# Altium project Power Board UCC28951.PrjPcb (part 4 of 4)

## Sheet E_Switch.SchDoc
size A3
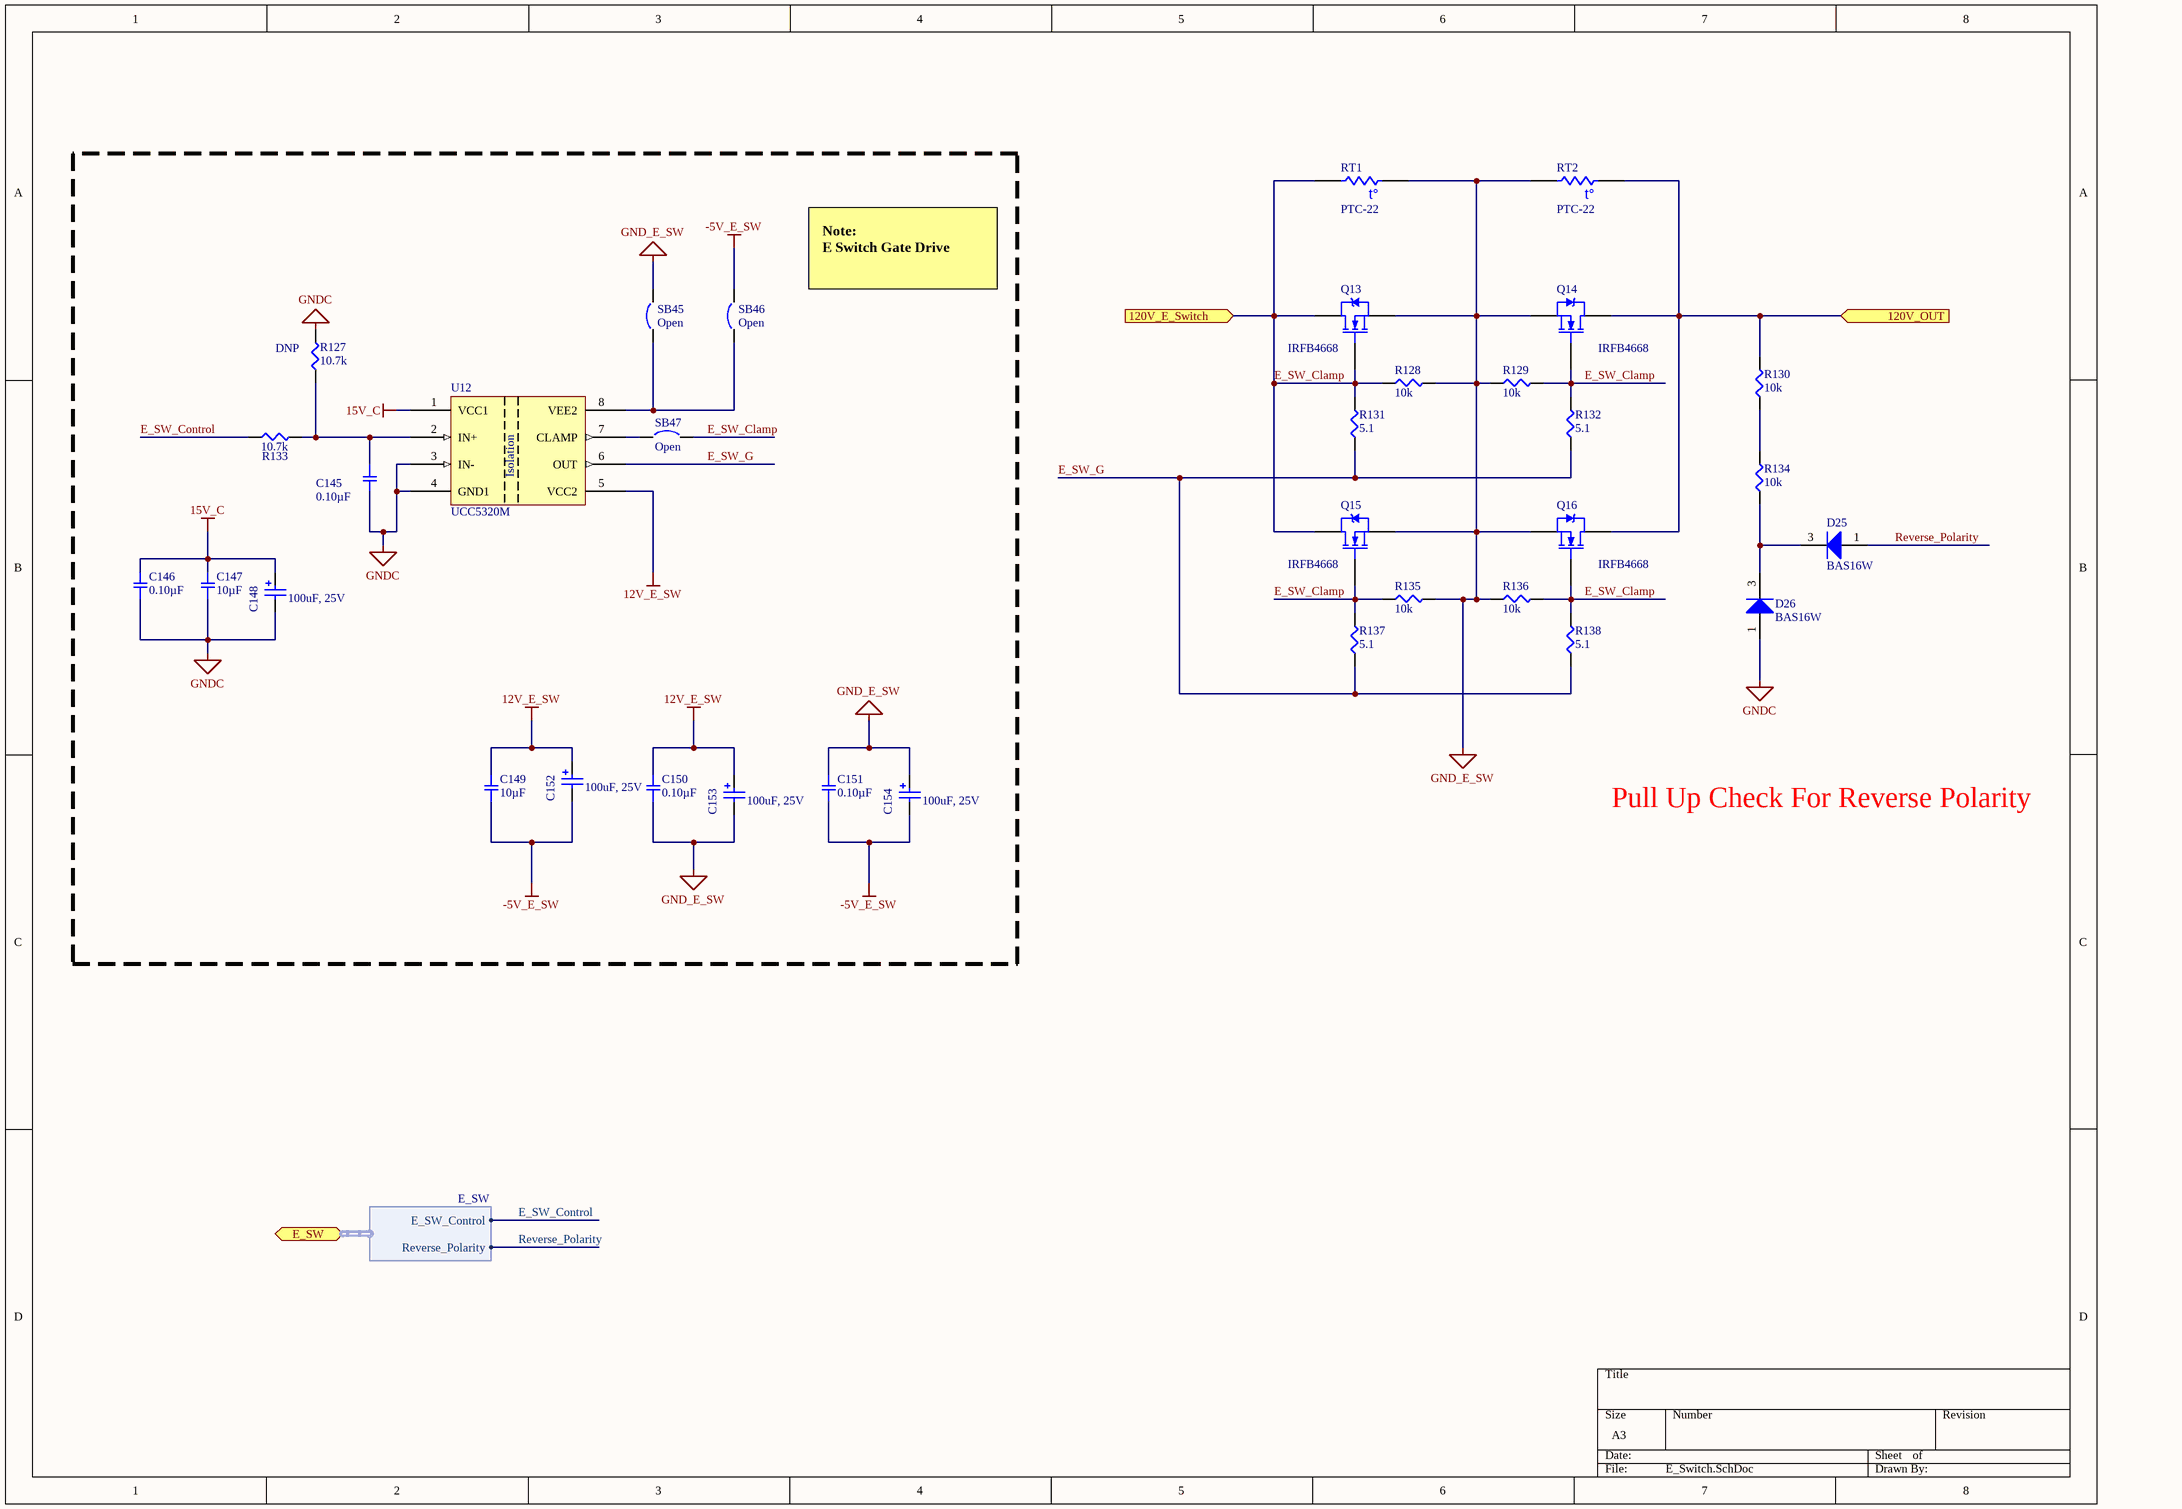
[diagram p17: E_Switch.SchDoc]

### Parts
(Parts that share a designator on the sheet are numbered #1, #2 ... from top to bottom, then left to right.)
C145#2  0.10µF  [SMD-0603C]
C146#2  0.10µF  [SMD-0805C]
C147#2  10µF  [SMD-0805C]
C148#2  100uF, 25V  [WCAP-ASLL_6.3x7.7]
C149#2  10µF  [SMD-0805C]
C150#2  0.10µF  [SMD-0805C]
C151#2  0.10µF  [SMD-0805C]
C152#2  100uF, 25V  [WCAP-ASLL_6.3x7.7]
C153#2  100uF, 25V  [WCAP-ASLL_6.3x7.7]
C154#2  100uF, 25V  [WCAP-ASLL_6.3x7.7]
D25  BAS16W  [SOT95P278X110-3N]
D26#2  BAS16W  [SOT95P278X110-3N]
Q13  IRFB4668  [TO-220AB]
Q14  IRFB4668  [TO-220AB]
Q15  IRFB4668  [TO-220AB]
Q16  IRFB4668  [TO-220AB]
R127#2  10.7k  [SMD-0603-RES]
R128#2  10k  [SMD-1206-RES]
R129#2  10k  [SMD-1206-RES]
R130#2  10k  [SMD-1206-RES]
R131#2  5.1  [SMD-1206-RES]
R132#2  5.1  [SMD-1206-RES]
R133#2  10.7k  [SMD-0603-RES]
R134#2  10k  [SMD-1206-RES]
R135  10k  [SMD-1206-RES]
R136  10k  [SMD-1206-RES]
R137  5.1  [SMD-1206-RES]
R138  5.1  [SMD-1206-RES]
RT1  PTC-22  [PTCEL-17R]
RT2  PTC-22  [PTCEL-17R]
SB45#2  Open  [Solder Bridge - HP]  (no BOM)
SB46  Open  [Solder Bridge - HP]  (no BOM)
SB47  Open  [Solder Bridge - HP]  (no BOM)
U12  UCC5320M  [SOIC127P570X175_HS-9N]

### Blocks framed on the sheet
DNP: C145#2 C146#2 C147#2 C148#2 C149#2 C150#2 C151#2 C152#2 C153#2 C154#2 R127#2 R133#2 SB45#2 SB46 SB47 U12

### Ports
120V_E_Switch (in), 120V_OUT (in), E_SW (bidir, harness E_SW)

### Harnesses
E_SW: E_SW_Control, Reverse_Polarity

### Nets
12V_E_SW: C149#2.2 C150#2.2 C152#2.2(P) C153#2.2(P) U12.5(VCC2)
15V_C: C146#2.2 C147#2.2 C148#2.2(P) U12.1(VCC1)
-5V_E_SW: C149#2.1 C151#2.1 C152#2.1(N) C154#2.1(N) SB46.2
GND_E_SW: C150#2.1 C151#2.2 C153#2.1(N) C154#2.2(P) Q13.3(S) Q14.3(S) Q15.3(S) Q16.3(S) R128#2.2 R129#2.1 R135.2 R136.1 RT1.1 RT2.2 SB45#2.2
GNDC: C145#2.2 C146#2.1 C147#2.1 C148#2.1(N) D26#2.1(A) R127#2.2 U12.3(IN-) U12.4(GND1)  [project net GND_LV]
120V_OUT: Q14.2(D) Q16.2(D) R130#2.2 RT2.1 ; port 120V_OUT
E_SW_Clamp: Q13.1(G) Q13.2(D) Q14.1(G) Q15.1(G) Q15.2(D) Q16.1(G) R128#2.1 R129#2.2 R131#2.2 R132#2.2 R135.1 R136.2 R137.2 R138.2 RT1.2 SB47.2 ; port 120V_E_Switch
E_SW_Control: R133#2.1 ; port E_SW.E_SW_Control
E_SW_G: R131#2.1 R132#2.1 R137.1 R138.1 U12.6(OUT)
Reverse_Polarity: D25.1(A) ; port E_SW.Reverse_Polarity
NetC145#2_1: C145#2.1 R127#2.1 R133#2.2 U12.2(IN+)
NetD25_3: D25.3(K) D26#2.3(K) R134#2.1
NetR130#2_1: R130#2.1 R134#2.2
NetSB45#2_1: SB45#2.1 SB46.1 U12.8(VEE2)
NetSB47_1: SB47.1 U12.7(CLAMP)

### Notes on the sheet
- Note:
  E Switch Gate Drive
- Pull Up Check For Reverse Polarity
- (in symbol Res Thermal) t°
- (in symbol UCC5320M) Isolation

### Library data of the parts
C145#2 = GCJ188R72A104KA01D: CAP CER 0.1UF 100V X7R 0603; Manufacturer: Murata Electronics North America; Factory Stock: 0; Unit Price (USD): 0.23; Minimum Quantity: 1; Tolerance: ±10%; Datasheets: http://www.murata.com/~/media/webrenewal/support/library/catalog/products/capacitor/mlcc/c03e.ashx; Image: //media.digikey.com/Renders/Murata%20Renders/0603%28LQG18%29.jpg; Digi-Key Part Number: 490-13420-1-ND; Part Number: GCJ188R72A104KA01D; Quantity Available: 2728; @ qty: 0; Packaging: Cut Tape (CT); Series: GCJ; Part Status: Active; Value: 0.10µF; Voltage: 100V; Temperature Coefficient: X7R; Operating Temperature: -55°C ~ 125°C; Features: Soft Termination; Ratings: AEC-Q200; Applications: Automotive, Boardflex Sensitive; Mounting Type: Surface Mount, MLCC; Package / Case: 0603 (1608 Metric); Size / Dimension: 0.063" L x 0.031" W (1.60mm x 0.80mm); Height - Seated (Max): -; Thickness (Max): 0.035" (0.90mm); Lead Spacing: -; Lead Style: -
C146#2 C150#2 C151#2 = GCD21BR71H104KA01L: CAP CER 0.1UF 50V X7R 0805; Manufacturer: Murata Electronics North America; Factory Stock: 0; Unit Price (USD): 0.24; Minimum Quantity: 1; Tolerance: ±10%; Datasheets: http://www.murata.com/~/media/webrenewal/support/library/catalog/products/capacitor/mlcc/c03e.ashx; Image: //media.digikey.com/Renders/Murata%20Renders/0805%28GxM6%29.jpg; Digi-Key Part Number: 490-11955-1-ND; Part Number: GCD21BR71H104KA01L; Quantity Available: 157; @ qty: 0; Packaging: Cut Tape (CT); Series: GCD; Part Status: Active; Value: 0.10µF; Voltage: 50V; Temperature Coefficient: X7R; Operating Temperature: -55°C ~ 125°C; Features: -; Ratings: AEC-Q200; Applications: Automotive; Mounting Type: Surface Mount, MLCC; Package / Case: 0805 (2012 Metric); Size / Dimension: 0.079" L x 0.049" W (2.00mm x 1.25mm); Height - Seated (Max): -; Thickness (Max): 0.049" (1.25mm); Lead Spacing: -; Lead Style: -
C147#2 C149#2 = GRM21BC8YA106KE11L: CAP CER 10UF 35V X6S 0805; Manufacturer: Murata Electronics North America; Factory Stock: 0; Unit Price (USD): 0.33; Minimum Quantity: 1; Tolerance: ±10%; Datasheets: http://www.murata.com/~/media/webrenewal/support/library/catalog/products/capacitor/mlcc/c02e.pdf; Image: //media.digikey.com/Renders/Murata%20Renders/0805%20(2012%20Metric)%20.85mm.jpg; Digi-Key Part Number: 490-10504-1-ND; Part Number: GRM21BC8YA106KE11L; Quantity Available: 72253; @ qty: 0; Packaging: Cut Tape (CT); Series: GRM; Part Status: Active; Value: 10µF; Voltage: 35V; Temperature Coefficient: X6S; Operating Temperature: -55°C ~ 105°C; Features: Derating Recommended; Ratings: -; Applications: General Purpose; Mounting Type: Surface Mount, MLCC; Package / Case: 0805 (2012 Metric); Size / Dimension: 0.079" L x 0.049" W (2.00mm x 1.25mm); Height - Seated (Max): -; Thickness (Max): 0.057" (1.45mm); Lead Spacing: -; Lead Style: -
C148#2 C152#2 C153#2 C154#2 = 865060445005: WCAP-ASLL SMT Aluminum Electrolytic Capacitors, D6.3mm x L7.7mm, 100uF, +/-20%, 25VDC; Dissipation Factor: 14%; Endurance: 2000h; Leakage Current: 25uA; Ripple Current max.: 300mA; Technical Reference: ASED077101M025DVCTCB000; ComponentLink1Description: Manufacturer; ComponentLink1URL: http://www.we-online.de; ComponentLink2Description: Datasheet; ComponentLink2URL: https://katalog.we-online.com/pbs/datasheet/865060445005.pdf; Length: 7.7mm; Mounting Technology: SMT; Operating Temperature: -55 to +105degC; Packaging: Tape and Reel; Published Date: August 2019; Capacitance: 100uF; Diameter: 6.3mm; Part Number: 865060445005; Publisher: Wurth Elektronik; Capacitance Tolerance: +/-20%; Rated Voltage: 25VDC
D25 D26#2 = BAS16: Silicon Switching Diode, SOT323, Reel, Green; Manufacturer: Infineon; IR (max): 100Â nA; Configuration: Single; VBR (min): 85Â V; VR (max): 80Â V; trr (max): 4Â ns; Green: TRUE; VF (max): 1.25Â V; IF (max): 250Â mA; Mounting Technology: Surface Mount; PackageReference: SOT323; ComponentLink2URL: http://www.infineon.com/dgdl/bas16series.pdf?folderId=db3a30431400ef6801141b5844e103ea&fileId=db3a30431400ef6801141b93811b03ff; Halogen-free: TRUE; ComponentLink2Description: Datasheet; PartNumber: BAS16W; ComponentLink1Description: Manufacturer URL; ComponentLink3URL: http://www.infineon.com/dgdl/SOT323-Package_Overview.pdf?folderId=db3a30431936bc4b0119533e1dcb3c92&fileId=db3a30431936bc4b011953495f283cb1; ComponentLink1URL: http://www.infineon.com/; PackageDescription: 3-Pin Small Outline Transistor Package, 1.25 x 2 mm Body, 0.65 mm Pitch; ComponentLink3Description: Package Specification
Q13-Q16 = NMOS-2: N-Channel Power MOSFET; Note: Pin 2 is electrically connected to pin 4.; Published: 8-Jun-2000; LatestRevisionDate: 17-Jul-2002; LatestRevisionNote: Re-released for DXP Platform.; DatasheetVersion: PD-9.814; PackageVersion: Feb-1997; PackageReference: TO-220AB; Publisher: Altium Limited; PackageDescription: TO, Thru-Hole, Vertical, Heatsink Mounted; 3 In-Line Leads; Pitch 2.54 mm; ComponentLink1Description: Manufacturer Link; ComponentLink1URL: http://www.irf.com/
R127#2 R133#2 = ERJ-3EKF1072V: RES SMD 10.7K OHM 1% 1/10W 0603; Manufacturer: Panasonic Electronic Components; Factory Stock: 0; Unit Price (USD): 0.00379; @ qty: 1500; Minimum Quantity: 1; Power (Watts): 0.1W, 1/10W; Temperature Coefficient: ±100ppm/°C; Part Number: ERJ-3EKF1072V; Datasheets: http://industrial.panasonic.com/www-cgi/jvcr13pz.cgi?E+PZ+3+AOA0002+ERJ3EKF1072V+7+WW; Image: //media.digikey.com/Photos/Panasonic%20Photos/MFG_ERJ-P6W%20Series.jpg; Digi-Key Part Number: P10.7KHCT-ND; Quantity Available: 142624; Packaging: Cut Tape (CT); Series: ERJ; Part Status: Active; Value: 10.7k; Tolerance: ±1%; Composition: Thick Film; Features: Automotive AEC-Q200; Operating Temperature: -55°C ~ 155°C; Package / Case: 0603 (1608 Metric); Supplier Device Package: 0603; Size / Dimension: 0.063" L x 0.031" W (1.60mm x 0.80mm); Height - Seated (Max): 0.022" (0.55mm); Number of Terminations: 2; Failure Rate: -
R128#2 R129#2 R130#2 R134#2 R135 R136 = ERJ-8ENF1002V: as R89-R92 on sheet Synchronous Rectification Stage; Part Number: ERJ-8ENF1002V; Datasheets: http://industrial.panasonic.com/www-cgi/jvcr13pz.cgi?E+PZ+3+AOA0002+ERJ8ENF1002V+7+WW; Image: //media.digikey.com/Renders/Panasonic%20Renders/ERJ-1206%20Pkg.jpg; Digi-Key Part Number: P10.0KFCT-ND; Quantity Available: 1108398; Packaging: Cut Tape (CT); Series: ERJ; Part Status: Active; Value: 10k; Tolerance: ±1%; Composition: Thick Film; Features: Automotive AEC-Q200; Operating Temperature: -55°C ~ 155°C; Package / Case: 1206 (3216 Metric); Supplier Device Package: 1206; Size / Dimension: 0.126" L x 0.063" W (3.20mm x 1.60mm); Height - Seated (Max): 0.028" (0.70mm); Number of Terminations: 2; Failure Rate: -
R131#2 R132#2 R137 R138 = ERJ-8BQF5R1V: as R85-R88 on sheet Synchronous Rectification Stage; Part Number: ERJ-8BQF5R1V; Datasheets: https://industrial.panasonic.com/cdbs/www-data/pdf/RDA0000/AOA0000C239.pdf; Image: //media.digikey.com/Renders/Panasonic%20Renders/ERJ-1206%20Pkg.jpg; Digi-Key Part Number: P17617CT-ND; Quantity Available: 4802; Packaging: Cut Tape (CT); Series: ERJ; Part Status: Active; Value: 5.1; Tolerance: ±1%; Composition: Thick Film; Features: Automotive AEC-Q200, Current Sense; Operating Temperature: -55°C ~ 125°C; Package / Case: 1206 (3216 Metric); Supplier Device Package: 1206; Size / Dimension: 0.126" L x 0.063" W (3.20mm x 1.60mm); Height - Seated (Max): 0.028" (0.70mm); Number of Terminations: 2; Failure Rate: -
RT1 RT2 = Res Thermal: PTC Thermistor; Published: 24-Mar-1999; LatestRevisionDate: 29-May-2009; LatestRevisionNote: IPC-7351 Footprint Added.; PackageVersion: Mar-2003; PackageReference: 6-0805; Publisher: Altium Limited; PackageDescription: Chip Resistor 0805 Case Size; Code_IPC: RESC2012
SB45#2 SB46 SB47 = Solder Bridge: Circuit Breaker; Published: 24-Mar-1999; Revision: July-2002: Re-released for DXP Platform.; Publisher: Altium Limited
U12 = UCC5320M: Single-Channel Isolated Gate Drivers; Supplier 1: Digi-Key; Supplier Part Number 1: 296-49025-1-ND

## Sheet Fan Control.SchDoc
size A3
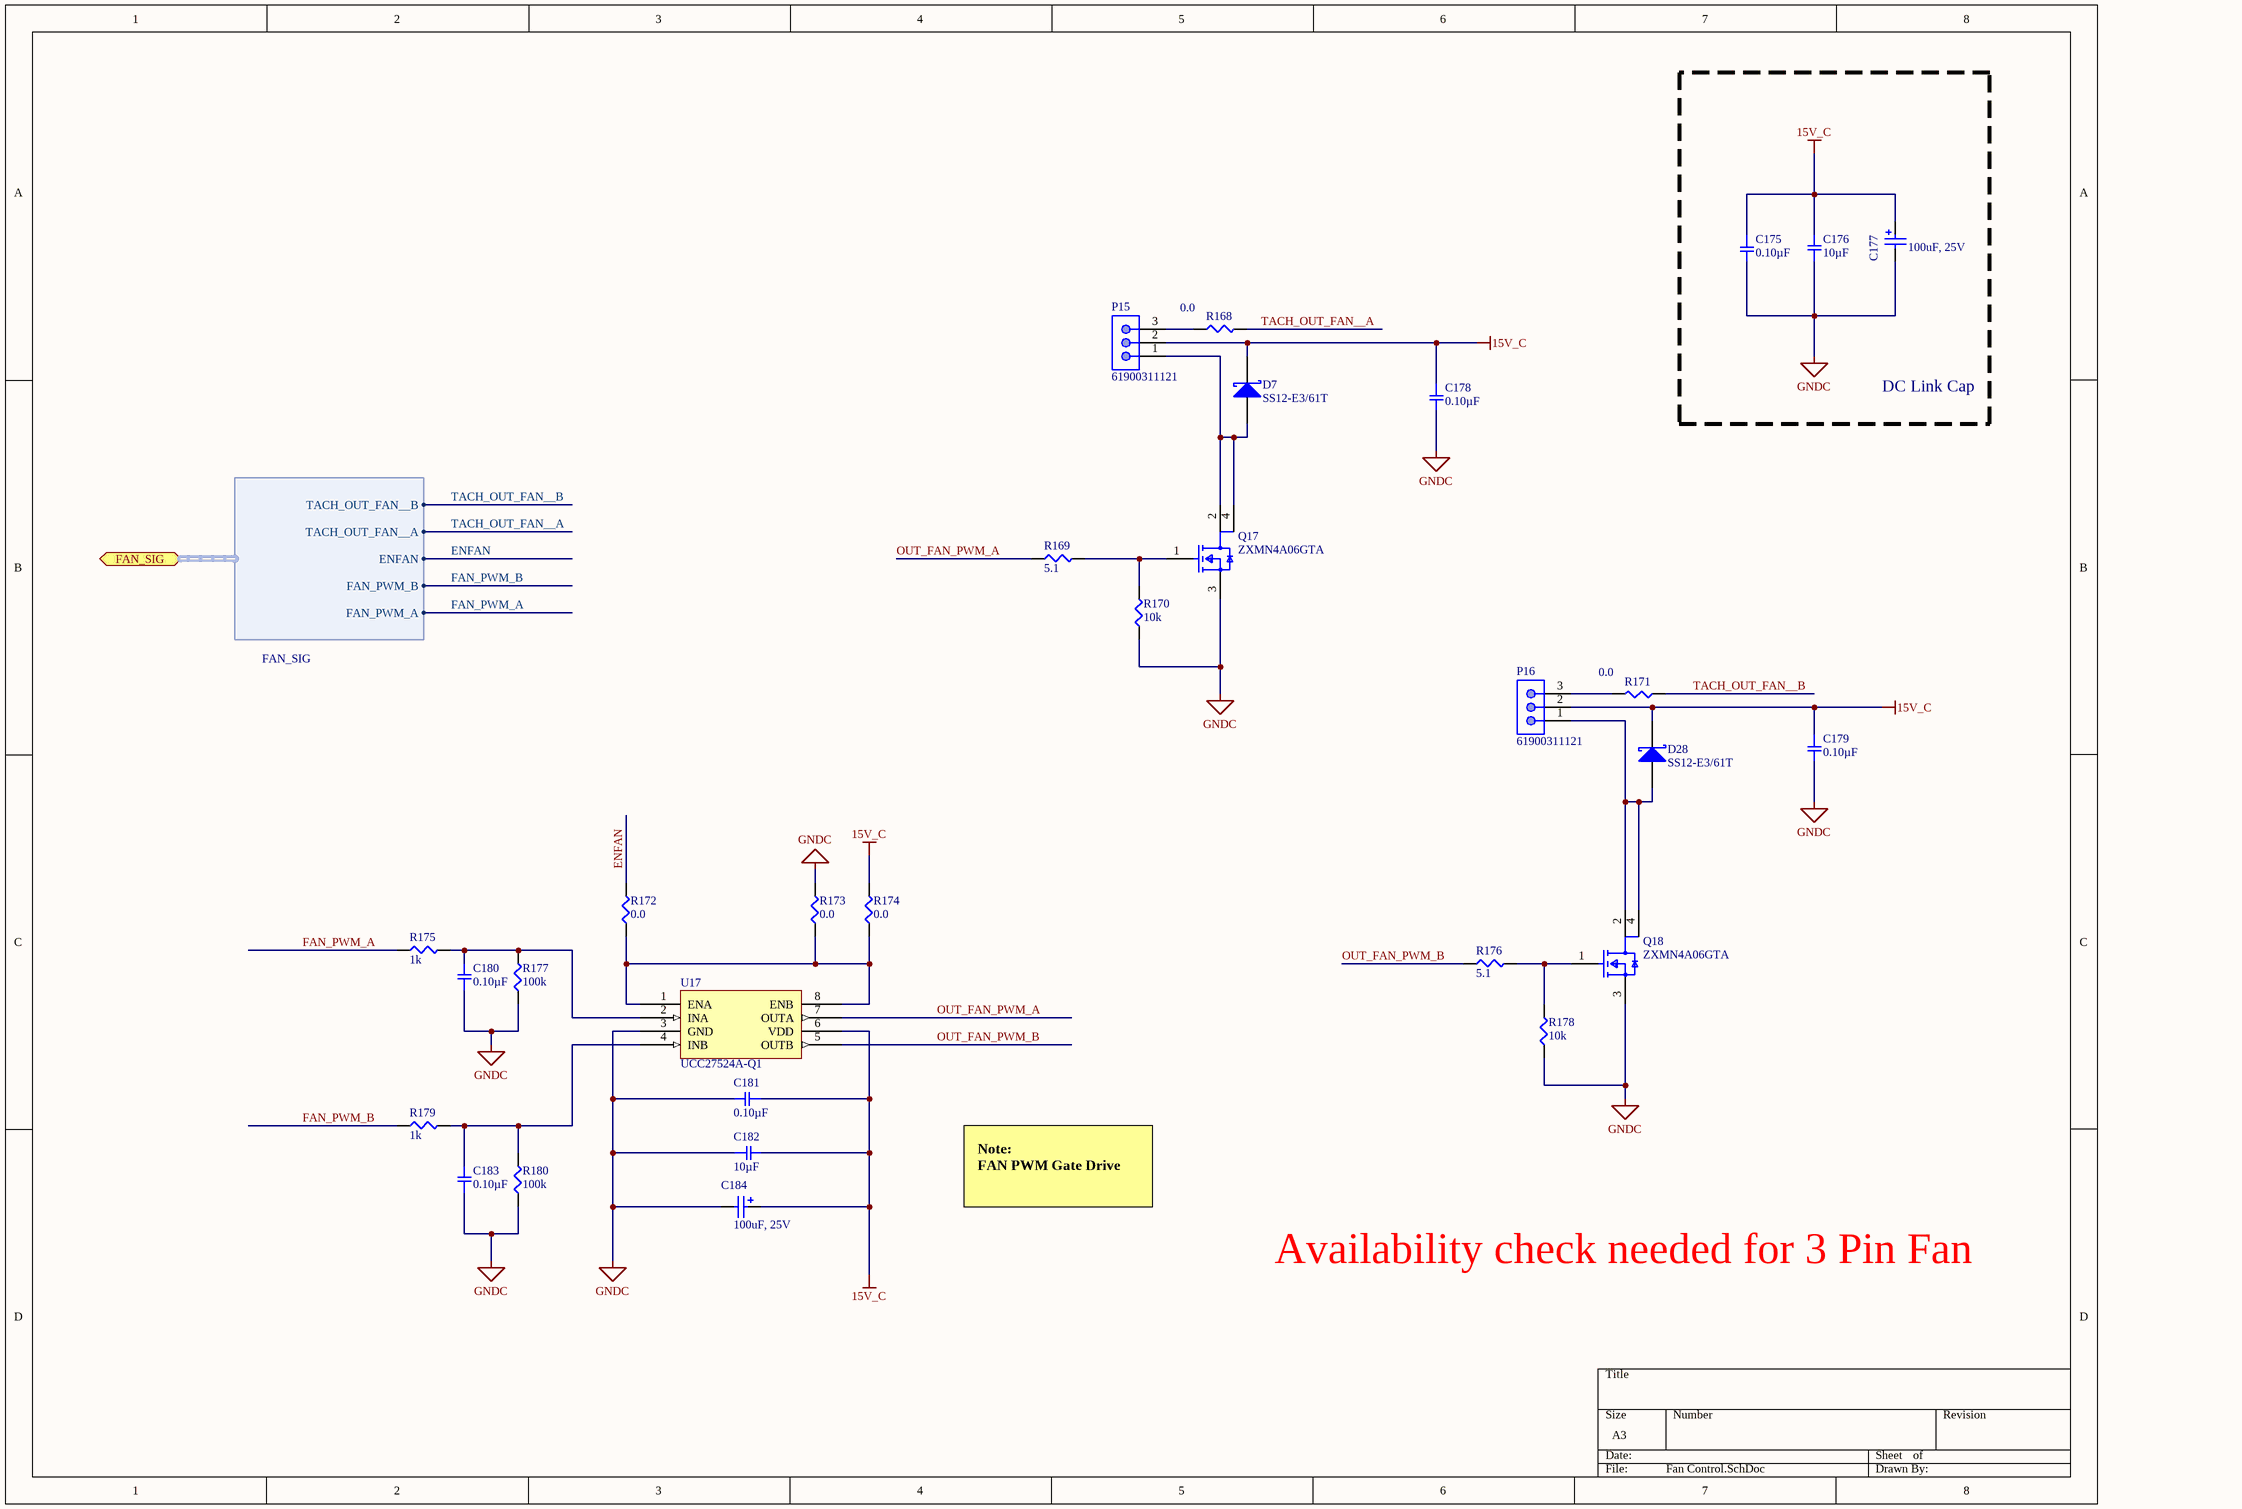
[diagram p18: Fan Control.SchDoc]

### Parts
(Parts that share a designator on the sheet are numbered #1, #2 ... from top to bottom, then left to right.)
C175#2  0.10µF  [SMD-0805C]
C176#2  10µF  [SMD-0805C]
C177#2  100uF, 25V  [WCAP-ASLL_6.3x7.7]
C178#2  0.10µF  [SMD-0805C]
C179#2  0.10µF  [SMD-0805C]
C180  0.10µF  [SMD-0805C]
C181  0.10µF  [SMD-0805C]
C182  10µF  [SMD-0805C]
C183  0.10µF  [SMD-0805C]
C184  100uF, 25V  [WCAP-ASLL_6.3x7.7]
D7#2  SS12-E3/61T  [VISH-DO-214AC_V]
D28  SS12-E3/61T  [VISH-DO-214AC_V]
P15#2  61900311121  [61900311121]
P16#2  61900311121  [61900311121]
Q17  ZXMN4A06GTA  [FP-SOT223-MFG]
Q18  ZXMN4A06GTA  [FP-SOT223-MFG]
R168  0.0  [SMD-0603-RES]
R169  5.1  [SMD-0805-RES]
R170  10k  [SMD-0805-RES]
R171  0.0  [SMD-0603-RES]
R172  0.0  [SMD-0603-RES]
R173  0.0  [SMD-0603-RES]
R174  0.0  [SMD-0603-RES]
R175  1k  [SMD-0603-RES]
R176  5.1  [SMD-0805-RES]
R177  100k  [SMD-0603-RES]
R178  10k  [SMD-0805-RES]
R179  1k  [SMD-0603-RES]
R180  100k  [SMD-0603-RES]
U17#2  UCC27524A-Q1  [SON65P300X75_HS-9N]

### Blocks framed on the sheet
DC Link Cap: C175#2 C176#2 C177#2

### Ports
FAN_SIG (bidir, harness FAN_SIG)

### Harnesses
FAN_SIG: FAN_PWM_A, FAN_PWM_B, ENFAN, TACH_OUT_FAN__A, TACH_OUT_FAN__B

### Nets
15V_C: C175#2.1 C176#2.2 C177#2.2(P) C178#2.1 C179#2.1 C181.1 C182.2 C184.2(P) D7#2.2(K) D28.2(K) P15#2.2 P16#2.2 R174.2 U17#2.6(VDD)
GNDC: C175#2.2 C176#2.1 C177#2.1(N) C178#2.2 C179#2.2 C180.1 C181.2 C182.1 C183.1 C184.1(N) Q17.3(S) Q18.3(S) R170.1 R173.2 R177.1 R178.1 R180.1 U17#2.3(GND)  [project net GND_LV]
ENFAN: R172.2 ; port FAN_SIG.ENFAN
FAN_PWM_A: R175.1 ; port FAN_SIG.FAN_PWM_A
FAN_PWM_B: R179.1 ; port FAN_SIG.FAN_PWM_B
OUT_FAN_PWM_A: R169.1 U17#2.7(OUTA)
OUT_FAN_PWM_B: R176.1 U17#2.5(OUTB)
TACH_OUT_FAN__A: R168.2 ; port FAN_SIG.TACH_OUT_FAN__A
TACH_OUT_FAN__B: R171.1 ; port FAN_SIG.TACH_OUT_FAN__B
NetC180_2: C180.2 R175.2 R177.2 U17#2.2(INA)
NetC183_2: C183.2 R179.2 R180.2 U17#2.4(INB)
NetD7#2_1: D7#2.1(A) P15#2.1 Q17.2(D) Q17.4(D)
NetD28_1: D28.1(A) P16#2.1 Q18.2(D) Q18.4(D)
NetP15#2_3: P15#2.3 R168.1
NetP16#2_3: P16#2.3 R171.2
NetQ17_1: Q17.1(G) R169.2 R170.2
NetQ18_1: Q18.1(G) R176.2 R178.2
NetR172_1: R172.1 R173.1 R174.1 U17#2.1(ENA) U17#2.8(ENB)

### Notes on the sheet
- Note:
  FAN PWM Gate Drive
- Availability check needed for 3 Pin Fan

### Library data of the parts
C175#2 C178#2 C179#2 C180 C181 C183 = GCD21BR71H104KA01L: as C146#2 on sheet E_Switch; Datasheets: http://www.murata.com/~/media/webrenewal/support/library/catalog/products/capacitor/mlcc/c03e.ashx; Image: //media.digikey.com/Renders/Murata%20Renders/0805%28GxM6%29.jpg; Digi-Key Part Number: 490-11955-1-ND; Part Number: GCD21BR71H104KA01L; Quantity Available: 157; @ qty: 0; Packaging: Cut Tape (CT); Series: GCD; Part Status: Active; Value: 0.10µF; Voltage: 50V; Temperature Coefficient: X7R; Operating Temperature: -55°C ~ 125°C; Features: -; Ratings: AEC-Q200; Applications: Automotive; Mounting Type: Surface Mount, MLCC; Package / Case: 0805 (2012 Metric); Size / Dimension: 0.079" L x 0.049" W (2.00mm x 1.25mm); Height - Seated (Max): -; Thickness (Max): 0.049" (1.25mm); Lead Spacing: -; Lead Style: -
C176#2 C182 = GRM21BC8YA106KE11L: as C147#2 on sheet E_Switch; Datasheets: http://www.murata.com/~/media/webrenewal/support/library/catalog/products/capacitor/mlcc/c02e.pdf; Image: //media.digikey.com/Renders/Murata%20Renders/0805%20(2012%20Metric)%20.85mm.jpg; Digi-Key Part Number: 490-10504-1-ND; Part Number: GRM21BC8YA106KE11L; Quantity Available: 72253; @ qty: 0; Packaging: Cut Tape (CT); Series: GRM; Part Status: Active; Value: 10µF; Voltage: 35V; Temperature Coefficient: X6S; Operating Temperature: -55°C ~ 105°C; Features: Derating Recommended; Ratings: -; Applications: General Purpose; Mounting Type: Surface Mount, MLCC; Package / Case: 0805 (2012 Metric); Size / Dimension: 0.079" L x 0.049" W (2.00mm x 1.25mm); Height - Seated (Max): -; Thickness (Max): 0.057" (1.45mm); Lead Spacing: -; Lead Style: -
C177#2 C184 = 865060445005: as C148#2 on sheet E_Switch; ComponentLink1Description: Manufacturer; ComponentLink1URL: http://www.we-online.de; ComponentLink2Description: Datasheet; ComponentLink2URL: https://katalog.we-online.com/pbs/datasheet/865060445005.pdf; Length: 7.7mm; Mounting Technology: SMT; Operating Temperature: -55 to +105degC; Packaging: Tape and Reel; Published Date: August 2019; Capacitance: 100uF; Diameter: 6.3mm; Part Number: 865060445005; Publisher: Wurth Elektronik; Capacitance Tolerance: +/-20%; Rated Voltage: 25VDC
D7#2 D28 = CMP-004-00017-1: Schottky Barrier Rectifier, 20 V, 1 A, -65 to 150 degC, 2-Pin DO-214AC (SMA), RoHS, Tape and Reel; Manufacturer: Vishay Semiconductor; Max Surge Current: 40A; Forward Voltage: 5dV; Forward Current: 1A; Peak Reverse Current: 6mA; Package Quantity: 1800; Datasheet URL: http://www.vishay.com/docs/88746/ss12.pdf; Case/Package: SMA; Package Description: 2-Pin Surface Mount Device, Body 4.245 x 2.665 mm; Pins: 2; Mounting Technology: SM; Min Operating Temperature: -65°C; Packaging: TapeandReel; Datasheet Version: Aug-15; Manufacturer URL: http://www.vishay.com/; RoHS Compliant: True; Package Reference: DO-214AC (SMA); Max Operating Temperature: 125°C
P15#2 P16#2 = 61900311121: WR-WTB THT Male Vertical Locking Header, pitch 2.54mm, 3p; Pin Number: 3; Contact Resistance: 20mOhm; Rated Current: 3A; Withstanding Voltage: 1000VAC; Working Voltage: 250VAC; ComponentLink1Description: Manufacturer; ComponentLink1URL: http://www.we-online.de; ComponentLink2Description: Datasheet; ComponentLink2URL: https://www.we-online.com/catalog/datasheet/61900311121.pdf; Pitch: 2.54mm; Published Date: January 2020; Publisher: Wurth Elektronik; Mounting Technology: THT; Packaging: Bag; Operating Temperature: -40 to +105degC; Part Number: 61900311121; Gender: Male; Type: Vertical
Q17 Q18 = CMP-12801-000020-1: MOSFET N-CH 40V 5A SOT223; Manufacturer: Diodes Inc.; Rthja Max: 62.5°C/W; Gate To Source Voltage: 20V; Number Of Channels: 1; Standoff Height: 0.01mm; Automotive Grade: Grade 0; Threshold Vgs Max: 2V; Drain To Source Resistance: 0.05Ω; Reverse Recovery Charge: 16.36nC; Reverse Recovery Time: 19.86ns; Input Capacitace At Vds: 770pF @ 40V; Max Forward Diode Voltage: 0.95V; Depletion Mode: False; Power Dissipation: 2W; Turn Off Delay Time: 28.61ns; Typ Forward Diode Voltage: 0.8V; Threshold Vgs Min: 1V; Pulse Drain Current: 22A; Gate Charge At Vgs: 18.2nC @ 10V; Transconductance: 8.7S; Max Junction Temp: +150°C; Turn On Delay Time: 2.55ns; Device Class L2: Transistors; Digikey Description: MOSFET N-CH 40V 5A SOT223; Ipc Land Pattern Name: SOT230P700X180-4; ComponentLink2Description: Datasheet; Manufacturer Part Number: ZXMN4A06GTA; Automotive: Yes; ComponentLink2URL: https://www.diodes.com/assets/Datasheets/ZXMN4A06G.pdf; Drain To Source Breakdown Voltage: 40V; Package: SOT223; Temperature Range High: +150°C; Height: 1.8mm; Octopart: https://octopart.com/zxmn4a06gta-diodes+inc.-660114; Mouser Description: MOSFET 40V N-Chnl UMOS; Lead Free: Yes; Number Of N Channels: 1; Device Class L1: Discrete Semiconductors; Drain To Source Voltage: 40V; RoHS: TRUE; Category: Trans; Temperature: -55°C to +150°C; Device Class L3: MOSFETs; Continuous Drain Current: 5A; Temperature Range Low: -55°C; Footprint Url: https://www.diodes.com/assets/Package-Files/SOT223.pdf
R168 R171-R174 = ERJ-3GEY0R00V: as R147-R152 on sheet Input Current Sense; Part Number: ERJ-3GEY0R00V; Datasheets: http://industrial.panasonic.com/www-cgi/jvcr13pz.cgi?E+PZ+3+AOA0001+ERJ3GEY0R00V+7+WW; Image: //media.digikey.com/Photos/Panasonic%20Photos/MFG_ERJ-P6W%20Series.jpg; Digi-Key Part Number: P0.0GCT-ND; Quantity Available: 4813372; Packaging: Cut Tape (CT); Series: ERJ; Part Status: Active; Value: 0.0; Tolerance: Jumper; Composition: Thick Film; Features: Automotive AEC-Q200; Temperature Coefficient: -; Operating Temperature: -55°C ~ 155°C; Package / Case: 0603 (1608 Metric); Supplier Device Package: 0603; Size / Dimension: 0.063" L x 0.031" W (1.60mm x 0.80mm); Height - Seated (Max): 0.022" (0.55mm); Number of Terminations: 2; Failure Rate: -
R169 R176 = ERJ-6BQF5R1V: RES SMD 5.1 OHM 1% 1/3W 0805; Manufacturer: Panasonic Electronic Components; Factory Stock: 0; Unit Price (USD): 0.05834; @ qty: 1500; Minimum Quantity: 1; Power (Watts): 0.333W, 1/3W; Temperature Coefficient: ±200ppm/°C; Part Number: ERJ-6BQF5R1V; Datasheets: https://industrial.panasonic.com/cdbs/www-data/pdf/RDA0000/AOA0000C239.pdf; Image: //media.digikey.com/Renders/Panasonic%20Renders/ERJ-0805%20Pkg.jpg; Digi-Key Part Number: P17511CT-ND; Quantity Available: 3194; Packaging: Cut Tape (CT); Series: ERJ; Part Status: Active; Value: 5.1; Tolerance: ±1%; Composition: Thick Film; Features: Automotive AEC-Q200, Current Sense; Operating Temperature: -55°C ~ 125°C; Package / Case: 0805 (2012 Metric); Supplier Device Package: 0805; Size / Dimension: 0.079" L x 0.049" W (2.00mm x 1.25mm); Height - Seated (Max): 0.028" (0.70mm); Number of Terminations: 2; Failure Rate: -
R170 R178 = ERJ-6ENF1002V: RES SMD 10K OHM 1% 1/8W 0805; Manufacturer: Panasonic Electronic Components; Factory Stock: 0; Unit Price (USD): 0.00729; @ qty: 1500; Minimum Quantity: 1; Power (Watts): 0.125W, 1/8W; Temperature Coefficient: ±100ppm/°C; Part Number: ERJ-6ENF1002V; Datasheets: http://industrial.panasonic.com/www-cgi/jvcr13pz.cgi?E+PZ+3+AOA0002+ERJ6ENF1002V+7+WW; Image: //media.digikey.com/Renders/Panasonic%20Renders/ERJ-0805%20Pkg.jpg; Digi-Key Part Number: P10.0KCCT-ND; Quantity Available: 3985614; Packaging: Cut Tape (CT); Series: ERJ; Part Status: Active; Value: 10k; Tolerance: ±1%; Composition: Thick Film; Features: Automotive AEC-Q200; Operating Temperature: -55°C ~ 155°C; Package / Case: 0805 (2012 Metric); Supplier Device Package: 0805; Size / Dimension: 0.079" L x 0.049" W (2.00mm x 1.25mm); Height - Seated (Max): 0.028" (0.70mm); Number of Terminations: 2; Failure Rate: -
R175 R179 = ERJ-3EKF1001V: RES SMD 1K OHM 1% 1/10W 0603; Manufacturer: Panasonic Electronic Components; Factory Stock: 0; Unit Price (USD): 0.00379; @ qty: 1500; Minimum Quantity: 1; Power (Watts): 0.1W, 1/10W; Temperature Coefficient: ±100ppm/°C; Part Number: ERJ-3EKF1001V; Datasheets: http://industrial.panasonic.com/www-cgi/jvcr13pz.cgi?E+PZ+3+AOA0002+ERJ3EKF1001V+7+WW; Image: //media.digikey.com/Photos/Panasonic%20Photos/MFG_ERJ-P6W%20Series.jpg; Digi-Key Part Number: P1.00KHCT-ND; Quantity Available: 5218845; Packaging: Cut Tape (CT); Series: ERJ; Part Status: Active; Value: 1k; Tolerance: ±1%; Composition: Thick Film; Features: Automotive AEC-Q200; Operating Temperature: -55°C ~ 155°C; Package / Case: 0603 (1608 Metric); Supplier Device Package: 0603; Size / Dimension: 0.063" L x 0.031" W (1.60mm x 0.80mm); Height - Seated (Max): 0.022" (0.55mm); Number of Terminations: 2; Failure Rate: -
R177 R180 = ERJ-3EKF1003V: RES SMD 100K OHM 1% 1/10W 0603; Manufacturer: Panasonic Electronic Components; Factory Stock: 0; Unit Price (USD): 0.00379; @ qty: 1500; Minimum Quantity: 1; Power (Watts): 0.1W, 1/10W; Temperature Coefficient: ±100ppm/°C; Part Number: ERJ-3EKF1003V; Datasheets: http://industrial.panasonic.com/www-cgi/jvcr13pz.cgi?E+PZ+3+AOA0002+ERJ3EKF1003V+7+WW; Image: //media.digikey.com/Photos/Panasonic%20Photos/MFG_ERJ-P6W%20Series.jpg; Digi-Key Part Number: P100KHCT-ND; Quantity Available: 2179804; Packaging: Cut Tape (CT); Series: ERJ; Part Status: Active; Value: 100k; Tolerance: ±1%; Composition: Thick Film; Features: Automotive AEC-Q200; Operating Temperature: -55°C ~ 155°C; Package / Case: 0603 (1608 Metric); Supplier Device Package: 0603; Size / Dimension: 0.063" L x 0.031" W (1.60mm x 0.80mm); Height - Seated (Max): 0.022" (0.55mm); Number of Terminations: 2; Failure Rate: -
U17#2 = UCC27524A

## Nets that join several sheets
2.5V_C: Output Current Sense (7 pins), Input Current Sense (7 pins)
5V_A: Auxillary Supply Break Out (P6.1 P6.2), Input Voltage Sense (R107.2)
5V_C: Gate Driver HV (SB8.2 SB24.2), 5V_Isolated_Bias (7 pins), Thermal Sense Network (22 pins), Output Sense Network (5 pins), Output Current Sense (C131.1 TP15.1 VR3.3), Input Sense Network (C5.1 C6.1 SB2.1 U1.8), Input Current Sense (C179#1.1 TP31.1 VR4.3), Input Voltage Sense (R121.2 R122.1 R124.2 U14#2.8)
12V_E_SW: 5V_Isolated_Bias (5 pins), E_Switch (5 pins)
15V_A: Gate Driver HV (SB11.2 SB27.2), Auxillary Supply Break Out (9 pins)
15V_B: Gate Driver HV (SB13.1 SB16.2 SB29.1 SB31.2), Auxillary Supply Break Out (9 pins), EMI Stage Break Out (6 pins)
15V_C: Gate Driver HV (R37.1 R42.1 SB7.2 SB23.2), Auxillary Supply Break Out (P6.5 P6.6 P6.11 P6.12), 5V_Isolated_Bias (5 pins), Output Sense Network (SB42.1), Input Sense Network (SB1.1), Gate Driver Rectifier (5 pins), E_Switch (C146#2.2 C147#2.2 C148#2.2 U12.1), Fan Control (14 pins)
-5V_A: Gate Driver HV (C23.1 SB5.1 VR1.2), Auxillary Supply Break Out (P7.5 P7.6)
-5V_B: Gate Driver HV (C50.1 SB15.1 VR2.2), Auxillary Supply Break Out (P7.7 P7.8)
-5V_C: Auxillary Supply Break Out (P6.3 P6.4), Output Sense Network (SB45#1.1), Input Sense Network (SB4.1)
-5V_E_SW: 5V_Isolated_Bias (5 pins), E_Switch (5 pins)
GND_E_SW: 5V_Isolated_Bias (6 pins), E_Switch (15 pins)
GND_HV: Power Circuit (9 pins), Gate Driver HV (SB17.2 SB21.2 SB32.2 SB35.2), Auxillary Supply Break Out (P5.1 P5.2 P5.3 P5.4), EMI Stage Break Out (23 pins), Input Voltage Sense (9 pins)
GND_LV: Power Circuit (13 pins), Gate Driver HV (18 pins), Auxillary Supply Break Out (P6.7 P6.8 P6.9 P6.10), 5V_Isolated_Bias (9 pins), Thermal Sense Network (21 pins), Output Sense Network (10 pins), Output Current Sense (9 pins), Input Sense Network (7 pins), Input Current Sense (10 pins), Input Voltage Sense (12 pins), Synchronous Rectification Stage (8 pins), Gate Driver Rectifier (9 pins), E_Switch (8 pins), Fan Control (18 pins)
GNDA: Gate Driver HV (9 pins), Auxillary Supply Break Out (24 pins)
GNDB: Gate Driver HV (9 pins), Auxillary Supply Break Out (P7.9 P7.10)
OP+: Input Sense Network (7 pins), Input Current Sense (5 pins), Input Voltage Sense (C141.1 C142.1 U13.4)
OP-: Input Sense Network (5 pins), Input Current Sense (C175#1.2 C176#1.2 U13.11 U17#1.11), Input Voltage Sense (C141.2 C142.2 U13.11)
OP_LVS_+: Output Sense Network (8 pins), Output Current Sense (C127.1 C128.1 R93.2 U7.4)
OP_LVS_-: Output Sense Network (6 pins), Output Current Sense (C127.2 C128.2 U7.11)
120_UFA-: Power Circuit (D6.1 T1.7), Synchronous Rectification Stage (Q11.2 Q12.2)
120_UFB-: Power Circuit (D6.3 T1.5), Synchronous Rectification Stage (Q9.2 Q10.2)
120V_LV: Power Circuit (14 pins), Output Sense Network (TP5.1 U6.4)
120V_Sense: PCIE98 Break Out (P12#1.B13), Output Sense Network (D14.1 SB41.1)
300V_HV: EMI Stage Break Out (C1.2 C2.1 C3.1 L1.2), Input Sense Network (TP1.1 U1.1 U1.2), Input Voltage Sense (R106.2)
300V_HV_Sense: Power Circuit (5 pins), Input Sense Network (U1.3 U1.4)
ACS_HV_OUT: Input Sense Network (TP2.1 U1.7), Input Current Sense (TP29.1 U17#1.5)
ACS_HV_OUT_AMP: PCIE98 Break Out (P12#1.B2), Input Current Sense (C174#2.2 D26#1.1 SB72.2 TP27.1)
ACS_LV_OUT: Output Sense Network (TP6.1 U6.3), Output Current Sense (TP13.1 U7.5)
ACS_LV_OUT_AMP: PCIE98 Break Out (P12#1.B12), Output Current Sense (C126.2 D19.1 SB68#2.2 TP11.1)
AMC_HV_OUT: PCIE98 Break Out (P12#1.B1), Input Voltage Sense (C137.2 R112.2)
DIS1: Gate Driver HV (C45.1 R34.2 U2.5), PCIE98 Break Out (P12#1.B5)
DIS2: Gate Driver HV (C73.1 R41.2 U3.5), PCIE98 Break Out (P12#1.B6)
E_SW_Clamp: Output Sense Network (R60.2 U6.5), E_Switch (16 pins)
E_SW_Control: PCIE98 Break Out (P12#1.B15), E_Switch (R133#2.1)
ENFAN: PCIE98 Break Out (P12#1.B18), Fan Control (R172.2)
ENSRG: PCIE98 Break Out (P12#1.B11), Gate Driver Rectifier (R66.2)
FAN_PWM_A: PCIE98 Break Out (P12#1.B16), Fan Control (R175.1)
FAN_PWM_B: PCIE98 Break Out (P12#1.B17), Fan Control (R179.1)
HV_RC: Auxillary Supply Break Out (P5.9 P5.10 P5.11 P5.12), EMI Stage Break Out (P3.11 P3.12)
INA1: Gate Driver HV (R32.1), PCIE98 Break Out (P12#1.B3)
INA2: Gate Driver HV (R39.1), PCIE98 Break Out (P12#1.B8)
INB1: Gate Driver HV (R33.1), PCIE98 Break Out (P12#1.B4)
INB2: Gate Driver HV (R40.1), PCIE98 Break Out (P12#1.B7)
OUT_RECTIFIER_A: Synchronous Rectification Stage (R81.1 R82.1 R85.1 R86.1), Gate Driver Rectifier (U8.7)
OUT_RECTIFIER_B: Synchronous Rectification Stage (R83.2 R84.2 R87.2 R88.2), Gate Driver Rectifier (U8.5)
OUTA1: Power Circuit (R6.1 R7.1 R10.1 R11.1), Gate Driver HV (U2.15)
OUTA2: Power Circuit (6 pins), Gate Driver HV (U3.15)
OUTB1: Power Circuit (5 pins), Gate Driver HV (U2.10)
OUTB2: Power Circuit (R21.2 R25.2), Gate Driver HV (U3.10)
Reverse_Polarity: PCIE98 Break Out (P12#1.B14), E_Switch (D25.1)
SRG_A: PCIE98 Break Out (P12#1.B10), Gate Driver Rectifier (R69.1)
SRG_B: PCIE98 Break Out (P12#1.B9), Gate Driver Rectifier (R71.1)
SWN1: Power Circuit (8 pins), Gate Driver HV (SB9.1 SB14.2)
SWN2: Power Circuit (7 pins), Gate Driver HV (SB25.1 SB30.2)
T1_SMB_INT: PCIE98 Break Out (P12#1.B24), Thermal Sense Network (U16.17)
T1_SMB_RST: PCIE98 Break Out (P12#1.B23), Thermal Sense Network (U16.3)
T1_SMB_SCL: PCIE98 Break Out (P12#1.B22), Thermal Sense Network (U16.18)
T1_SMB_SDA: PCIE98 Break Out (P12#1.B21), Thermal Sense Network (U16.19)
TACH_OUT_FAN__A: PCIE98 Break Out (P12#1.B20), Fan Control (R168.2)
TACH_OUT_FAN__B: PCIE98 Break Out (P12#1.B19), Fan Control (R171.1)